# EAGLE schematic Schematics (EAGLE 9.7.0)
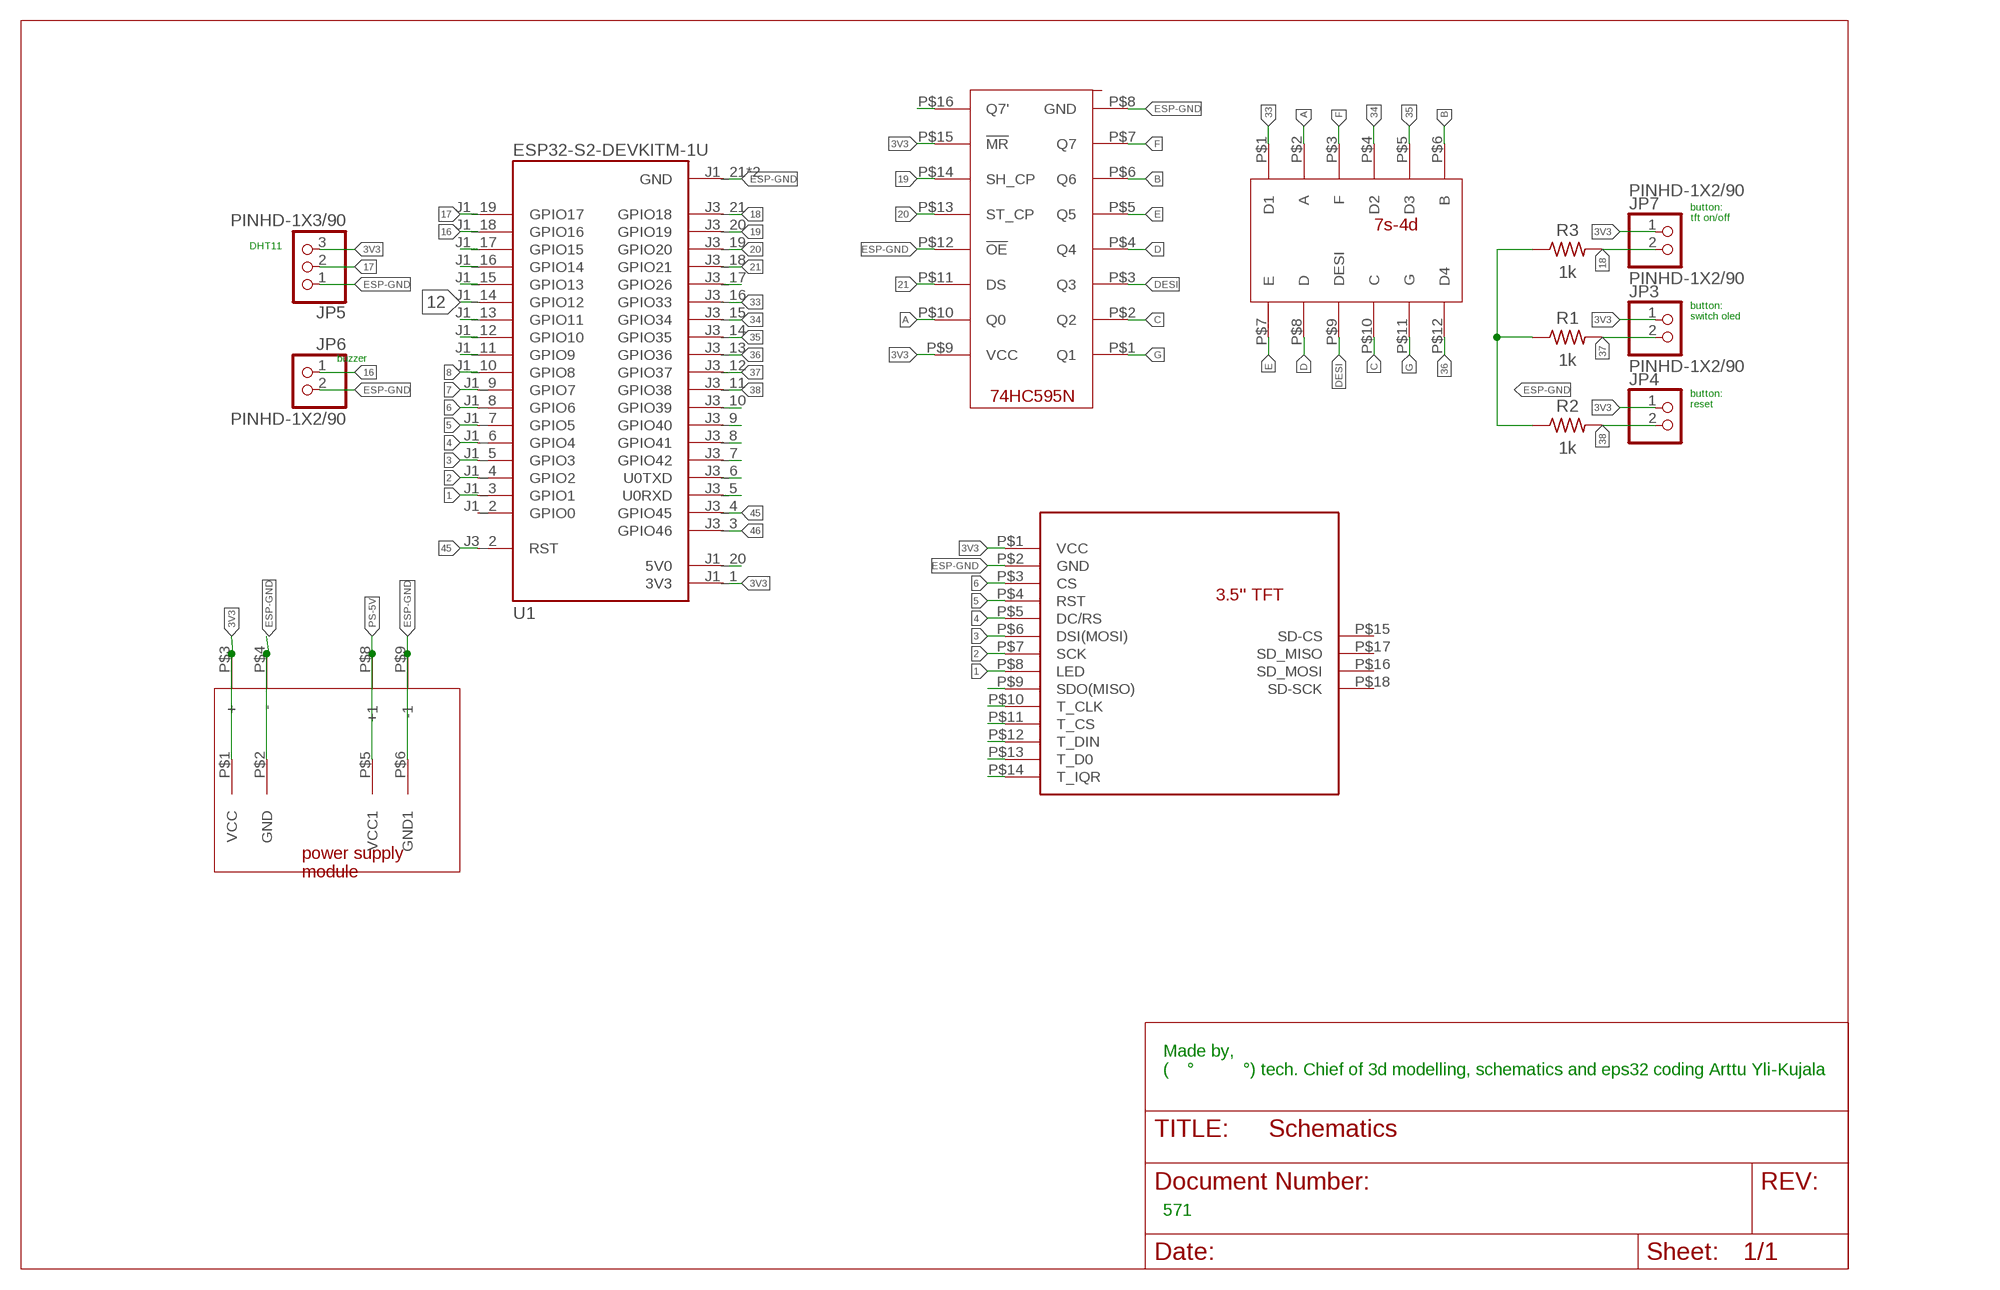
[diagram p0: schematic, sheet 1]

## Parts
JP3  PINHD-1X2/90  [1X02/90]
JP4  PINHD-1X2/90  [1X02/90]
JP5  PINHD-1X3/90  [1X03/90]
JP6  PINHD-1X2/90  [1X02/90]
JP7  PINHD-1X2/90  [1X02/90]
R1  1k  R-US_AXIAL-7.2MM-PITCH  [RESAD724W46L381D178B]
R2  1k  R-US_AXIAL-7.2MM-PITCH  [RESAD724W46L381D178B]
R3  1k  R-US_AXIAL-7.2MM-PITCH  [RESAD724W46L381D178B]
U1  ESP32-S2-DEVKITM-1U  [XCVR_ESP32-S2-DEVKITM-1U]
U$1  3.5TFTWQ  [3.5TFT]
U$2  POWERSUPPLYMODULE  [POWERSUPPLYMODULE]
U$4  7S-4D  [7S-4D]
U$7  OIK74HC595N  [74HC595N]

## Nets
0: U$1.P$9(SDO(MISO)) U$1.P$13(T_D0)
1: U1.J1_3(GPIO1) U$1.P$8(LED) U$1.P$12(T_DIN)
2: U1.J1_4(GPIO2) U$1.P$7(SCK) U$1.P$11(T_CS)
3: U1.J1_5(GPIO3) U$1.P$6(DSI(MOSI)) U$1.P$10(T_CLK)
3V3: JP3.1 JP4.1 JP5.3 JP7.1 U1.J1_1(3V3) U$1.P$1(VCC) U$2.P$1(VCC) U$2.P$3(+) U$7.P$9(VCC) U$7.P$15(!MR)
4: U1.J1_6(GPIO4) U$1.P$5(DC/RS)
5: U1.J1_7(GPIO5) U$1.P$4(RST)
6: U1.J1_8(GPIO6) U$1.P$3(CS)
7: U1.J1_9(GPIO7)
8: U1.J1_10(GPIO8)
9: U1.J1_11(GPIO9)
10: U1.J1_12(GPIO10)
11: U1.J1_13(GPIO11)
12: U1.J1_14(GPIO12)
13: U1.J1_15(GPIO13)
14: U1.J1_16(GPIO14)
15: U1.J1_17(GPIO15)
16: JP6.1 U1.J1_18(GPIO16)
17: JP5.2 U1.J1_19(GPIO17)
18: JP7.2 R3.2 U1.J3_21(GPIO18)
19: U1.J3_20(GPIO19) U$7.P$14(SH_CP)
20: U1.J3_19(GPIO20) U$7.P$13(ST_CP)
21: U1.J3_18(GPIO21) U$7.P$11(DS)
26: U1.J3_17(GPIO26)
33: U1.J3_16(GPIO33) U$4.P$1(D1)
34: U1.J3_15(GPIO34) U$4.P$4(D2)
35: U1.J3_14(GPIO35) U$4.P$5(D3)
36: U1.J3_13(GPIO36) U$4.P$12(D4)
37: JP3.2 R1.2 U1.J3_12(GPIO37)
38: JP4.2 R2.2 U1.J3_11(GPIO38)
39: U1.J3_10(GPIO39)
40: U1.J3_9(GPIO40)
41: U1.J3_8(GPIO41)
42: U1.J3_7(GPIO42)
45: U1.J3_2(RST) U1.J3_4(GPIO45)
46: U1.J3_3(GPIO46)
A: U$4.P$2(A) U$7.P$10(Q0)
B: U$4.P$6(B) U$7.P$6(Q6)
C: U$4.P$10(C) U$7.P$2(Q2)
D: U$4.P$8(D) U$7.P$4(Q4)
DESI: U$4.P$9(DESI) U$7.P$3(Q3)
E: U$4.P$7(E) U$7.P$5(Q5)
ESP-5V: U1.J1_20(5V0)
ESP-GND: JP5.1 JP6.2 R1.1 R2.1 R3.1 U1.J1_21(GND) U1.J3_1(GND) U$1.P$2(GND) U$2.P$2(GND) U$2.P$4(-) U$2.P$6(GND1) U$2.P$9(-1) U$7.P$8(GND) U$7.P$12(!OE)
F: U$4.P$3(F) U$7.P$7(Q7)
G: U$4.P$11(G) U$7.P$1(Q1)
N$1: U$1.P$14(T_IQR)
N$4: U$7.P$16(Q7')
PS-5V: U$2.P$5(VCC1) U$2.P$8(+1)
RX: U1.J3_5(U0RXD)
TX: U1.J3_6(U0TXD)
Unconnected: U1.J1_2(GPIO0) U$1.P$15(SD-CS) U$1.P$16(SD_MOSI) U$1.P$17(SD_MISO) U$1.P$18(SD-SCK)

## Notes on the sheet
- button:
  tft on/off
- DHT11
- button:
  switch oled
- buzzer
- button:
  reset
- Made by, 
  ( ͡° ͜ʖ ͡°) tech. Chief of 3d modelling, schematics and eps32 coding Arttu Yli-Kujala
- 571

## Library data of the parts
JP3 JP4 JP6 JP7 = Connector:PINHD-1X2: PIN HEADER; CATEGORY: Headers; DESCRIPTION: Header, Right Angle, 2 Position; MANUFACTURER: Generic; MPN: Generic; OPERATING_TEMPERATURE: Generic; PART_STATUS: Active; PITCH: 0.100" (2.54mm); ROHS_COMPLIANCE: Generic; SERIES: Generic; SUB-CATEGORY: Headers, Male Pins; TYPE: Board to Board or Cable, Unshrouded, Through Hole, Right Angle
JP5 = Connector:PINHD-1X3: PIN HEADER; CATEGORY: Headers; DESCRIPTION: Header, Right Angle, 3 Position; MANUFACTURER: Generic; MPN: Generic; OPERATING_TEMPERATURE: Generic; PART_STATUS: Active; PITCH: 0.100" (2.54mm); ROHS_COMPLIANCE: Generic; SERIES: Generic; SUB-CATEGORY: Headers, Male Pins; TYPE: Board to Board or Cable, Unshrouded, Through Hole, Right Angle
R1-R3 = Resistor:R-US: Resistor Fixed - ANSI; CATEGORY: Resistor; SUB-CATEGORY: Fixed
U1 = ESP32-S2-DEVKITM-1U:ESP32-S2-DEVKITM-1U: WiFi Development Tools (802.11) [ENGINEERING SAMPLES ONLY]General-Purpose Development Board, embeds ESP32-S2-MINI-1U, 4 MB flash; MANUFACTURER: Espressif; PARTREV: 1.0; STANDARD: Manufacturer Recommendations
U$1 = tft 3.5'':3.5TFT
U$2 = power supply module:POWERSUPPLYMODULE
U$4 = 7s 4digit:7S-4D
U$7 = Library:OIK74HC595N